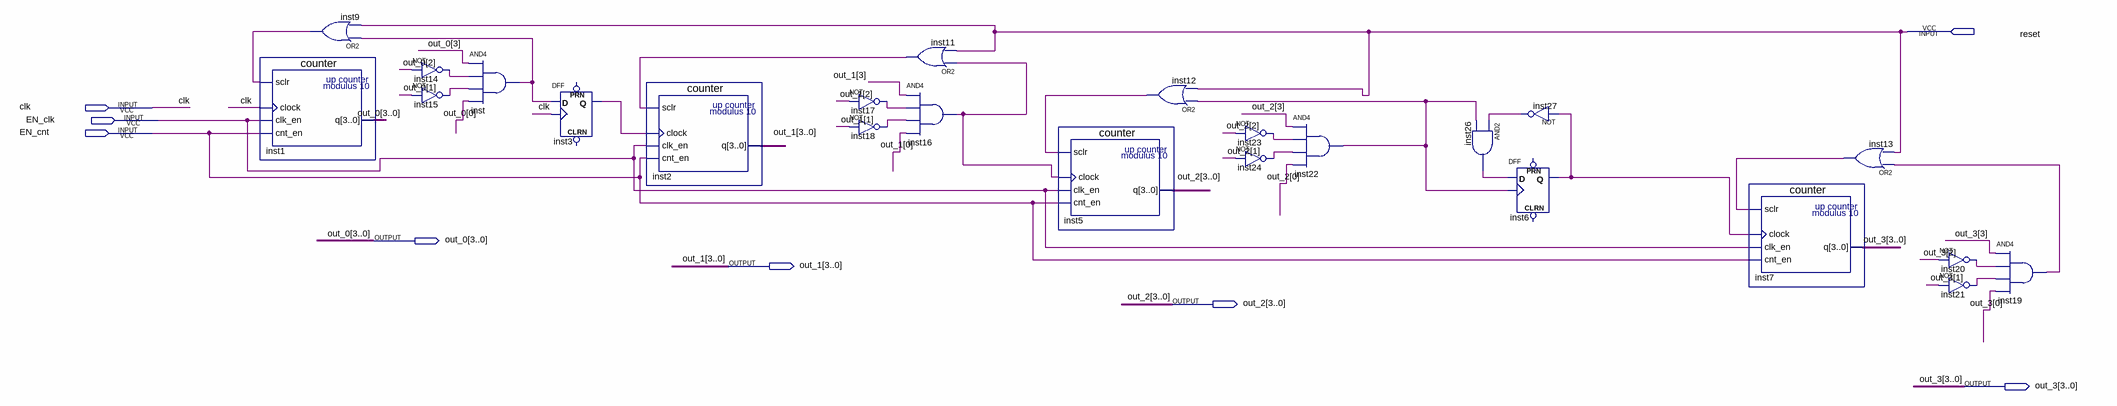
[diagram p0: schematic sheet]
// Quartus schematic counters.bdf as structural Verilog: 24 symbols, 8 pins
module counters (
  input  reset,
  input  clk,
  input  EN_clk,
  input  EN_cnt,
  output [3:0] out_0,
  output [3:0] out_1,
  output [3:0] out_2,
  output [3:0] out_3
);

  wire inst3_q, inst6_q, inst9_out, inst11_out, inst12_out, inst13_out, inst14_out, inst15_out, inst16_out,
       inst17_out, inst18_out, inst19_out, inst20_out, inst21_out, inst22_out, inst23_out, inst24_out,
       inst26_out, inst27_out, inst_out;

  counter inst1 (.sclr(inst9_out), .clock(clk), .clk_en(EN_clk), .cnt_en(EN_cnt), .q(out_0));
  or inst9 (inst9_out, inst_out, reset);
  not inst14 (inst14_out, out_0[2]);
  not inst15 (inst15_out, out_0[1]);
  and inst (inst_out, out_0[3], inst14_out, inst15_out, out_0[0]);
  DFF inst3 (.CLK(clk), .D(inst_out), .Q(inst3_q));  // open: CLRN, PRN
  counter inst2 (.sclr(inst11_out), .clock(inst3_q), .clk_en(EN_clk), .cnt_en(EN_cnt), .q(out_1));
  not inst17 (inst17_out, out_1[2]);
  not inst18 (inst18_out, out_1[1]);
  or inst11 (inst11_out, inst16_out, reset);
  and inst16 (inst16_out, out_1[3], inst17_out, inst18_out, out_1[0]);
  counter inst5 (.sclr(inst12_out), .clock(inst16_out), .clk_en(EN_clk), .cnt_en(EN_cnt), .q(out_2));
  or inst12 (inst12_out, inst22_out, reset);
  not inst23 (inst23_out, out_2[2]);
  not inst24 (inst24_out, out_2[1]);
  and inst22 (inst22_out, out_2[3], inst23_out, inst24_out, out_2[0]);
  and inst26 (inst26_out, inst27_out, inst22_out);
  not inst27 (inst27_out, inst6_q);
  DFF inst6 (.CLK(inst22_out), .D(inst26_out), .Q(inst6_q));  // open: CLRN, PRN
  counter inst7 (.sclr(inst13_out), .clock(inst6_q), .clk_en(EN_clk), .cnt_en(EN_cnt), .q(out_3));
  or inst13 (inst13_out, inst19_out, reset);
  not inst20 (inst20_out, out_3[2]);
  not inst21 (inst21_out, out_3[1]);
  and inst19 (inst19_out, out_3[3], inst20_out, inst21_out, out_3[0]);
endmodule
